# EAGLE schematic Rapide64a (EAGLE 6.3)
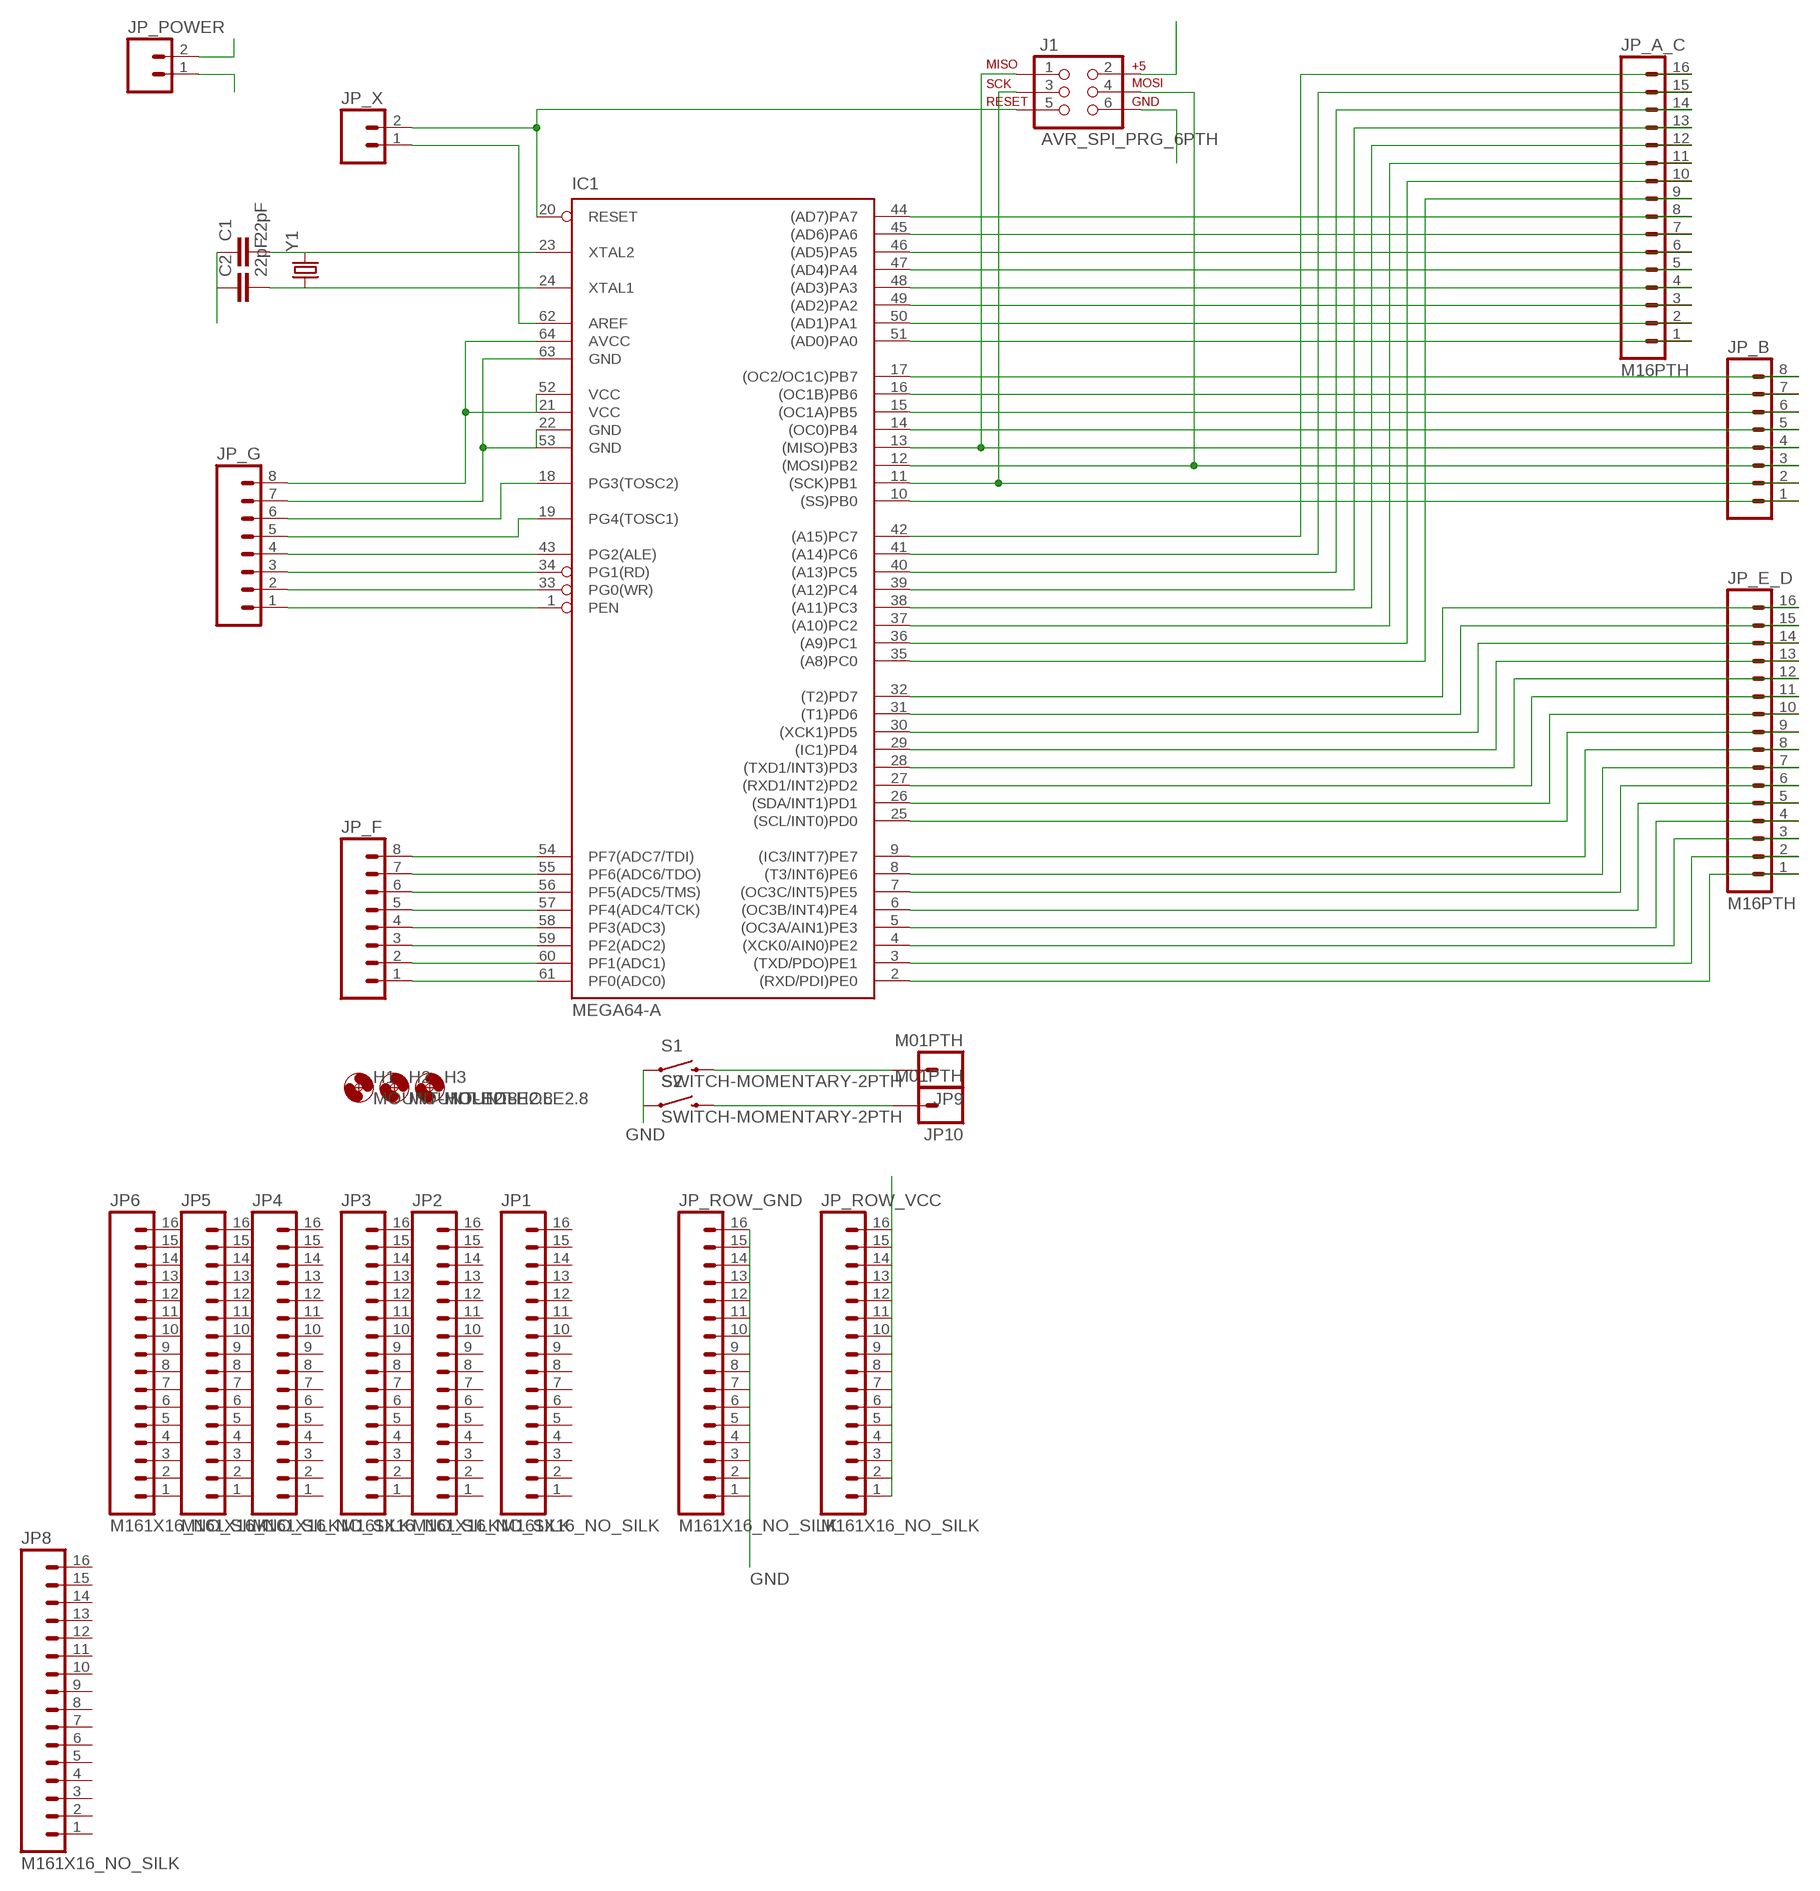
[diagram p0: schematic, sheet 1]

## Parts
C1  22pF  C-EU025-024X044  [C025-024X044]
C2  22pF  C-EU025-024X044  [C025-024X044]
H1  MOUNT-HOLE2.8  [2,8]
H2  MOUNT-HOLE2.8  [2,8]
H3  MOUNT-HOLE2.8  [2,8]
IC1  MEGA64-A  [TQFP64]
J1  AVR_SPI_PRG_6PTH  [2X3]
JP1  M161X16_NO_SILK  [1X16_NO_SILK]
JP2  M161X16_NO_SILK  [1X16_NO_SILK]
JP3  M161X16_NO_SILK  [1X16_NO_SILK]
JP4  M161X16_NO_SILK  [1X16_NO_SILK]
JP5  M161X16_NO_SILK  [1X16_NO_SILK]
JP6  M161X16_NO_SILK  [1X16_NO_SILK]
JP8  M161X16_NO_SILK  [1X16_NO_SILK]
JP9  M01PTH  [1X01]
JP10  M01PTH  [1X01]
JP_A_C  M16PTH  [1X16]
JP_B  M081X08  [1X08]
JP_E_D  M16PTH  [1X16]
JP_F  M081X08  [1X08]
JP_G  M081X08  [1X08]
JP_POWER  M02PTH  [1X02]
JP_ROW_GND  M161X16_NO_SILK  [1X16_NO_SILK]
JP_ROW_VCC  M161X16_NO_SILK  [1X16_NO_SILK]
JP_X  M02PTH  [1X02]
S1  SWITCH-MOMENTARY-2PTH  [TACTILE-PTH]
S2  SWITCH-MOMENTARY-2PTH  [TACTILE-PTH]
Y1  CRYSTALHC49UV  [HC49U-V]

## Nets
GND: C1.1 C2.1 IC1.22(GND) IC1.53(GND) IC1.63(GND) J1.6 JP_G.7 JP_POWER.1 JP_ROW_GND.1 JP_ROW_GND.2 JP_ROW_GND.3 JP_ROW_GND.4 JP_ROW_GND.5 JP_ROW_GND.6 JP_ROW_GND.7 JP_ROW_GND.8 JP_ROW_GND.9 JP_ROW_GND.10 JP_ROW_GND.11 JP_ROW_GND.12 JP_ROW_GND.13 JP_ROW_GND.14 JP_ROW_GND.15 JP_ROW_GND.16 S1.1 S2.1
N$1: IC1.2((RXD/PDI)PE0) JP_E_D.1
N$2: IC1.6((OC3B/INT4)PE4) JP_E_D.5
N$3: IC1.7((OC3C/INT5)PE5) JP_E_D.6
N$4: IC1.8((T3/INT6)PE6) JP_E_D.7
N$5: IC1.25((SCL/INT0)PD0) JP_E_D.9
N$6: IC1.9((IC3/INT7)PE7) JP_E_D.8
N$7: IC1.26((SDA/INT1)PD1) JP_E_D.10
N$8: IC1.27((RXD1/INT2)PD2) JP_E_D.11
N$9: IC1.58(PF3(ADC3)) JP_F.4
N$10: IC1.57(PF4(ADC4/TCK)) JP_F.5
N$11: IC1.56(PF5(ADC5/TMS)) JP_F.6
N$12: IC1.55(PF6(ADC6/TDO)) JP_F.7
N$13: IC1.54(PF7(ADC7/TDI)) JP_F.8
N$15: IC1.11((SCK)PB1) J1.3 JP_B.2
N$16: IC1.10((SS)PB0) JP_B.1
N$17: IC1.49((AD2)PA2) JP_A_C.3
N$18: IC1.17((OC2/OC1C)PB7) JP_B.8
N$20: IC1.48((AD3)PA3) JP_A_C.4
N$21: IC1.47((AD4)PA4) JP_A_C.5
N$22: IC1.46((AD5)PA5) JP_A_C.6
N$23: IC1.45((AD6)PA6) JP_A_C.7
N$24: IC1.44((AD7)PA7) JP_A_C.8
N$25: IC1.35((A8)PC0) JP_A_C.9
N$26: IC1.36((A9)PC1) JP_A_C.10
N$27: IC1.37((A10)PC2) JP_A_C.11
N$28: IC1.38((A11)PC3) JP_A_C.12
N$29: IC1.39((A12)PC4) JP_A_C.13
N$30: IC1.40((A13)PC5) JP_A_C.14
N$31: IC1.41((A14)PC6) JP_A_C.15
N$32: IC1.42((A15)PC7) JP_A_C.16
N$35: IC1.12((MOSI)PB2) J1.4 JP_B.3
N$36: IC1.13((MISO)PB3) J1.1 JP_B.4
N$41: JP9.1 S1.3
N$42: IC1.14((OC0)PB4) JP_B.5
N$43: IC1.51((AD0)PA0) JP_A_C.1
N$44: IC1.50((AD1)PA1) JP_A_C.2
N$45: IC1.15((OC1A)PB5) JP_B.6
N$46: JP10.1 S2.3
N$48: IC1.16((OC1B)PB6) JP_B.7
N$49: IC1.1(PEN) JP_G.1
N$50: IC1.33(PG0(WR)) JP_G.2
N$51: IC1.34(PG1(RD)) JP_G.3
N$52: IC1.43(PG2(ALE)) JP_G.4
N$53: IC1.19(PG4(TOSC1)) JP_G.5
N$54: IC1.18(PG3(TOSC2)) JP_G.6
N$57: IC1.20(RESET) J1.5 JP_X.2
N$58: IC1.62(AREF) JP_X.1
N$59: C1.2 IC1.23(XTAL2) Y1.2
N$60: C2.2 IC1.24(XTAL1) Y1.1
N$61: IC1.3((TXD/PDO)PE1) JP_E_D.2
N$62: IC1.4((XCK0/AIN0)PE2) JP_E_D.3
N$63: IC1.5((OC3A/AIN1)PE3) JP_E_D.4
N$64: IC1.28((TXD1/INT3)PD3) JP_E_D.12
N$65: IC1.29((IC1)PD4) JP_E_D.13
N$66: IC1.30((XCK1)PD5) JP_E_D.14
N$67: IC1.31((T1)PD6) JP_E_D.15
N$68: IC1.32((T2)PD7) JP_E_D.16
N$70: IC1.61(PF0(ADC0)) JP_F.1
N$71: IC1.60(PF1(ADC1)) JP_F.2
N$72: IC1.59(PF2(ADC2)) JP_F.3
VCC: IC1.21(VCC) IC1.52(VCC) IC1.64(AVCC) J1.2 JP_G.8 JP_POWER.2 JP_ROW_VCC.1 JP_ROW_VCC.2 JP_ROW_VCC.3 JP_ROW_VCC.4 JP_ROW_VCC.5 JP_ROW_VCC.6 JP_ROW_VCC.7 JP_ROW_VCC.8 JP_ROW_VCC.9 JP_ROW_VCC.10 JP_ROW_VCC.11 JP_ROW_VCC.12 JP_ROW_VCC.13 JP_ROW_VCC.14 JP_ROW_VCC.15 JP_ROW_VCC.16
Unconnected: JP1.1 JP1.2 JP1.3 JP1.4 JP1.5 JP1.6 JP1.7 JP1.8 JP1.9 JP1.10 JP1.11 JP1.12 JP1.13 JP1.14 JP1.15 JP1.16 JP2.1 JP2.2 JP2.3 JP2.4 JP2.5 JP2.6 JP2.7 JP2.8 JP2.9 JP2.10 JP2.11 JP2.12 JP2.13 JP2.14 JP2.15 JP2.16 JP3.1 JP3.2 JP3.3 JP3.4 JP3.5 JP3.6 JP3.7 JP3.8 JP3.9 JP3.10 JP3.11 JP3.12 JP3.13 JP3.14 JP3.15 JP3.16 JP4.1 JP4.2 JP4.3 JP4.4 JP4.5 JP4.6 JP4.7 JP4.8 JP4.9 JP4.10 JP4.11 JP4.12 JP4.13 JP4.14 JP4.15 JP4.16 JP5.1 JP5.2 JP5.3 JP5.4 JP5.5 JP5.6 JP5.7 JP5.8 JP5.9 JP5.10 JP5.11 JP5.12 JP5.13 JP5.14 JP5.15 JP5.16 JP6.1 JP6.2 JP6.3 JP6.4 JP6.5 JP6.6 JP6.7 JP6.8 JP6.9 JP6.10 JP6.11 JP6.12 JP6.13 JP6.14 JP6.15 JP6.16 JP8.1 JP8.2 JP8.3 JP8.4 JP8.5 JP8.6 JP8.7 JP8.8 JP8.9 JP8.10 JP8.11 JP8.12 JP8.13 JP8.14 JP8.15 JP8.16

## Library data of the parts
C1 C2 = resistor:C-EU: CAPACITOR, European symbol
H1-H3 = holes:MOUNT-HOLE: MOUNTING HOLE with drill center marker
IC1 = atmel:MEGA64: MICROCONTROLLER 64 Kbytes FLASH 4 Kbytes SRAM 2 Kbytes EEPROM DUAL USART 8-channel 10 bit ADC Source: avr.lbr; MPN: ATMEGA64-16AU; OC_FARNELL: 9171355; OC_NEWARK: 01M6899
J1 = SparkFun-Connectors:AVR_SPI_PRG_6: AVR ISP 6 Pin This is the reduced ISP connector for AVR programming. Common on Arduino. This footprint will take up less PCB space and can be used with a 10-pin to 6-pin adapter such as SKU: BOB-08508
JP1-JP6 JP8 JP_A_C JP_E_D JP_ROW_GND JP_ROW_VCC = SparkFun-Connectors:M16: 1x16 .1" header
JP9 JP10 = SparkFun-Connectors:M01: Header 1 Standard 1-pin 0.1" header. Use with straight break away headers (SKU : PRT-00116), right angle break away headers (PRT-00553), swiss pins (PRT-00743), machine pins (PRT-00117), and female headers (PRT-00115).
JP_B JP_F JP_G = SparkFun-Connectors:M08: Header 8 Standard 8-pin 0.1" header. Use with straight break away headers (SKU : PRT-00116), right angle break away headers (PRT-00553), swiss pins (PRT-00743), machine pins (PRT-00117), and female headers (PRT-00115).
JP_POWER JP_X = SparkFun-Connectors:M02: Header 2 Standard 2-pin 0.1" header. Use with straight break away headers (SKU : PRT-00116), right angle break away headers (PRT-00553), swiss pins (PRT-00743), machine pins (PRT-00117), and female headers (PRT-00115). Molex polarized connector foot print use with SKU : PRT-08233 with associated crimp pins and housings.
S1 S2 = SparkFun-Electromechanical:SWITCH-MOMENTARY-2: Various NO switches- pushbuttons, reed, etc
Y1 = SparkFun-FreqCtrl:CRYSTAL: Various standard crystals. Proven footprints. Spark Fun Electronics SKU : COM-00534